# EAGLE design openlrsng (EAGLE 6.4)
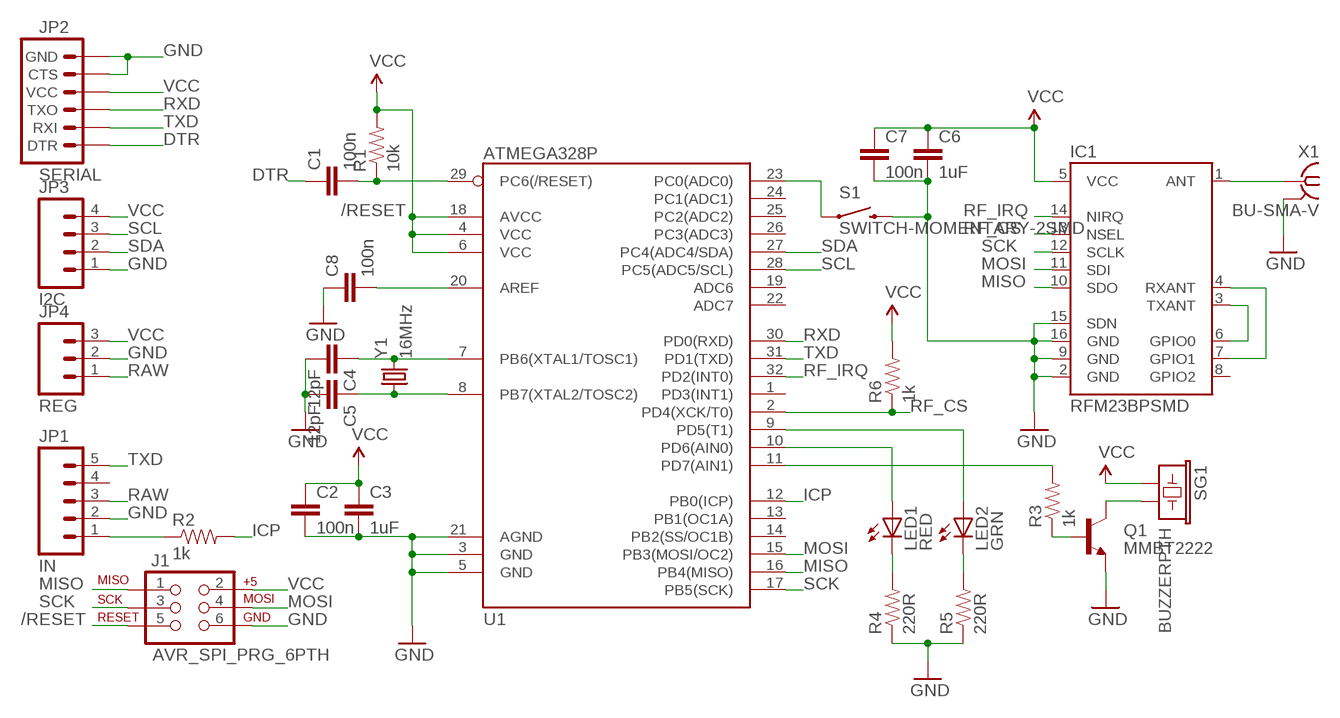
[diagram p0: schematic, sheet 1]

## Parts
C1  100n  CAP0805  [0805]
C2  100n  CAP0805  [0805]
C3  1uF  CAP0805  [0805]
C4  12pF  CAP0805  [0805]
C5  12pF  CAP0805  [0805]
C6  1uF  CAP0805  [0805]
C7  100n  CAP0805  [0805]
C8  100n  CAP0805  [0805]
IC1  RFM23BPSMD  [RFM23BP-S2]
J1  AVR_SPI_PRG_6PTH  [2X3]
JP1  IN  M05PTH  [1X05]
JP2  SERIAL  ARDUINO_SERIAL_PROGRAMPTH  [1X06]
JP3  I2C  M04PTH  [1X04]
JP4  REG  M03PTH  [1X03]
LED1  RED  LED3MM  [LED3MM]
LED2  GRN  LED3MM  [LED3MM]
Q1  MMBT2222  TRANSISTOR_NPNSOT23-3  [SOT23-3]
R1  10k  RESISTOR0402-RES  [0402-RES]
R2  1k  RESISTOR0402-RES  [0402-RES]
R3  1k  RESISTOR0402-RES  [0402-RES]
R4  220R  RESISTOR0402-RES  [0402-RES]
R5  220R  RESISTOR0402-RES  [0402-RES]
R6  1k  RESISTOR0402-RES  [0402-RES]
S1  SWITCH-MOMENTARY-2SMD  [TACTILE_SWITCH_SMD]
SG1  BUZZERPTH  [BUZZER-12MM]
U1  ATMEGA328P  ATMEGA328_SMT  [TQFP32-08]
X1  BU-SMA-V  [BU-SMA-V]
Y1  16MHz  CRYSTAL3.2X2.5  [CRYSTAL-SMD-5X3]

## Nets
/RESET: C1.2 J1.5 R1.1 U1.29(PC6(/RESET))
DTR: C1.1 JP2.1(DTR)
GND: C2.2 C3.2 C4.2 C5.2 C6.2 C7.2 C8.1 IC1.2(GND) IC1.9(GND) IC1.15(SDN) IC1.16(GND) J1.6 JP1.2 JP2.5(CTS) JP2.6(GND) JP3.1 JP4.2 Q1.2(E) R4.1 R5.1 S1.3 U1.3(GND) U1.5(GND) U1.21(AGND) X1.2 X1.3 X1.4 X1.5
ICP: R2.2 U1.12(PB0(ICP))
MISO: IC1.10(SDO) J1.1 U1.16(PB4(MISO))
MOSI: IC1.11(SDI) J1.4 U1.15(PB3(MOSI/OC2))
N$1: IC1.3(TXANT) IC1.6(GPIO0)
N$2: IC1.4(RXANT) IC1.7(GPIO1)
N$3: JP1.1 R2.1
N$4: R3.2 U1.11(PD7(AIN1))
N$5: Q1.1(B) R3.1
N$6: Q1.3(C) SG1.-
N$7: LED1.A U1.10(PD6(AIN0))
N$8: LED2.A U1.9(PD5(T1))
N$9: LED1.K(C) R4.2
N$10: LED2.K(C) R5.2
N$11: C4.1 U1.7(PB6(XTAL1/TOSC1)) Y1.3
N$12: C5.1 U1.8(PB7(XTAL2/TOSC2)) Y1.1
N$13: IC1.1(ANT) X1.1
N$14: C8.2 U1.20(AREF)
N$15: S1.1 U1.23(PC0(ADC0))
RAW: JP1.3 JP4.1
RF_CS: IC1.13(NSEL) R6.1 U1.2(PD4(XCK/T0))
RF_IRQ: IC1.14(NIRQ) U1.32(PD2(INT0))
RXD: JP2.3(TXO) U1.30(PD0(RXD))
SCK: IC1.12(SCLK) J1.3 U1.17(PB5(SCK))
SCL: JP3.3 U1.28(PC5(ADC5/SCL))
SDA: JP3.2 U1.27(PC4(ADC4/SDA))
TXD: JP1.5 JP2.2(RXI) U1.31(PD1(TXD))
VCC: C2.1 C3.1 C6.1 C7.1 IC1.5(VCC) J1.2 JP2.4(VCC) JP3.4 JP4.3 R1.2 R6.2 SG1.+ U1.4(VCC) U1.6(VCC) U1.18(AVCC)
Unconnected: IC1.8(GPIO2) JP1.4 U1.1(PD3(INT1)) U1.13(PB1(OC1A)) U1.14(PB2(SS/OC1B)) U1.19(ADC6) U1.22(ADC7) U1.24(PC1(ADC1)) U1.25(PC2(ADC2)) U1.26(PC3(ADC3))

## Library data of the parts
C1-C8 = SparkFun-Capacitors:CAP: Capacitor Standard 0603 ceramic capacitor, and 0.1" leaded capacitor.
IC1 = RFM23:RFM23BP: The RFM23BP is a medium power, low cost radio that is capable of operating in the 434MHz and 900MHz open bands. It's frequency is software defined and there are some very good libraries written for it.
J1 = SparkFun-Connectors:AVR_SPI_PRG_6: AVR ISP 6 Pin This is the reduced ISP connector for AVR programming. Common on Arduino. This footprint will take up less PCB space and can be used with a 10-pin to 6-pin adapter such as SKU: BOB-08508
JP1 = SparkFun-Connectors:M05: Header 5 Standard 5-pin 0.1" header. Use with straight break away headers (SKU : PRT-00116), right angle break away headers (PRT-00553), swiss pins (PRT-00743), machine pins (PRT-00117), and female headers (PRT-00115). Molex polarized connector foot print use with SKU : PRT-08230 with associated crimp pins and housings.
JP2 = SparkFun-Connectors:ARDUINO_SERIAL_PROGRAM: FTDI connector footprints
JP3 = SparkFun-Connectors:M04: Header 4 Standard 4-pin 0.1" header. Use with straight break away headers (SKU : PRT-00116), right angle break away headers (PRT-00553), swiss pins (PRT-00743), machine pins (PRT-00117), and female headers (PRT-00115). Molex polarized connector foot print use with SKU : PRT-08231 with associated crimp pins and housings. 1MM SMD Version SKU: PRT-10208
JP4 = SparkFun-Connectors:M03: Header 3 Standard 3-pin 0.1" header. Use with straight break away headers (SKU : PRT-00116), right angle break away headers (PRT-00553), swiss pins (PRT-00743), machine pins (PRT-00117), and female headers (PRT-00115). Molex polarized connector foot print use with SKU : PRT-08232 with associated crimp pins and housings.
LED1 LED2 = SparkFun-LED:LED: LEDs Standard schematic elements and footprints for 5mm, 3mm, 1206, and 0603 sized LEDs. 5mm - Spark Fun Electronics SKU : COM-00529 (and others)
Q1 = SparkFun-DiscreteSemi:TRANSISTOR_NPN: Generic NPN BJT. MMBT2222 is the common NPN we use. Double check against datasheet- not all devices are the same!
R1-R6 = SparkFun-Resistors:RESISTOR: Resistor Basic schematic elements and footprints for 0603, 1206, and PTH resistors.
S1 = SparkFun-Electromechanical:SWITCH-MOMENTARY-2: Various NO switches- pushbuttons, reed, etc
SG1 = SparkFun-Electromechanical:BUZZER: Buzzer 12mm Spark Fun Electronics SKU : Comp-Buzzer
U1 = SparkFun-DigitalIC:ATMEGA328_SMT: 32-Pin Atmega328 part Commonly used on Arduino compatible boards Available in QFP and QFN packages TQFP is IC-09069 QFN is non-stock; PROD_ID: IC-09069
X1 = con-coax:BU-SMA-V: FEMALE SMA CONNECTOR Radiall distributor RS 112-3794; OC_FARNELL: unknown; OC_NEWARK: unknown
Y1 = crystal_3225:CRYSTAL: Various standard crystals. Proven footprints. Spark Fun Electronics SKU : COM-00534

## Board
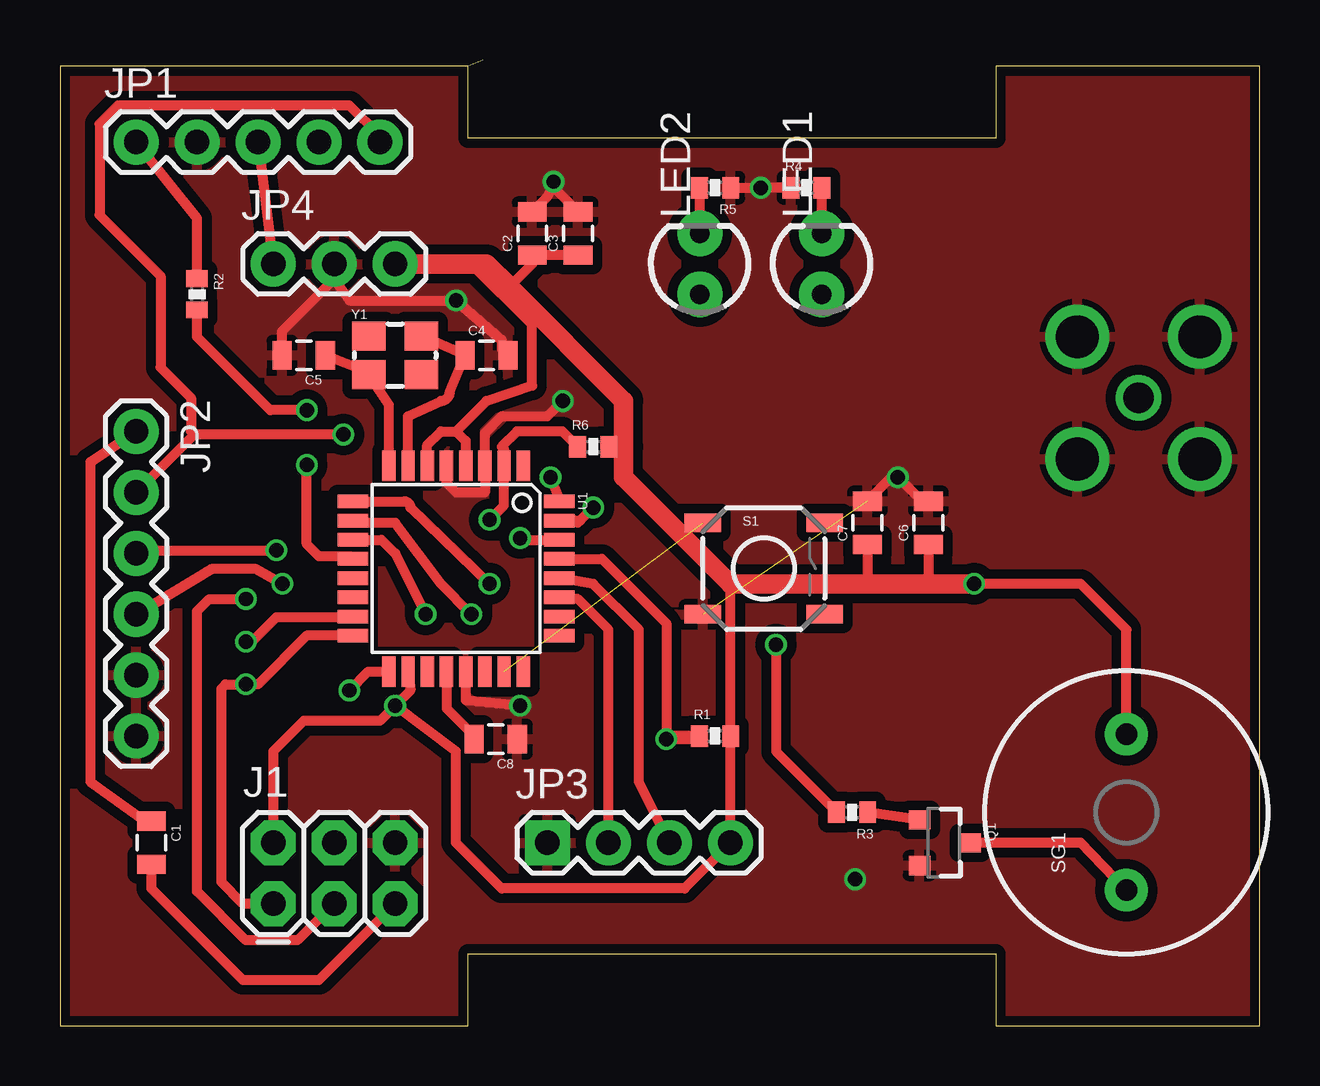
[diagram p1: board, top side]
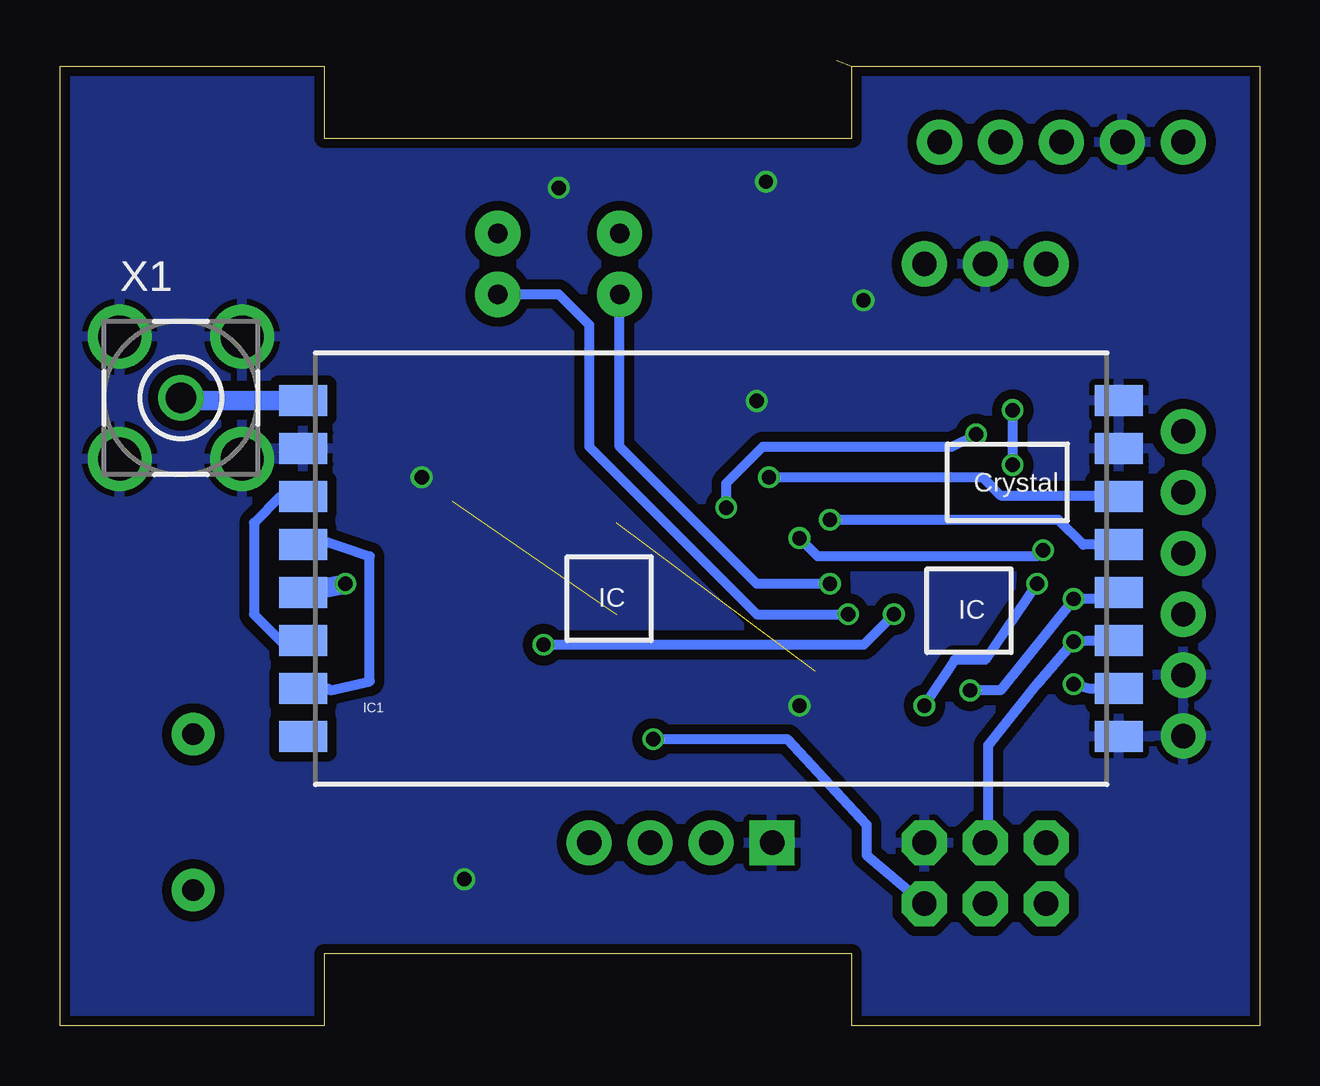
[diagram p2: board, bottom side, seen from below]

Size 50 x 40.25 mm. Coordinates in mm from the lower left corner, seen from the top.
Outline: 17,40 17,37 39,37 39,40 50,40 50,0 39,0 39,3 17,3 17,0 0,0 0,40 17,40
Outline: 17.64,40.25 17,40
Copper layers (1*16): Top 0.035mm / dielectric 1.5mm / Bottom 0.035mm
Design rules "ITEADstudio_DRC": minimum track width 6mil, minimum drill 12mil, track to track 6mil, track to pad 6mil, pad to pad 6mil, via to via 6mil, smd to smd 0mil, copper to edge 10mil, drill to drill 10mil, minimum pad ring 10mil, minimum via ring 6mil, stop-mask expansion 2mil, vias tented up to drill 100mil, thermal gap 10mil

### Footprints (pad centres in the part's own frame; a part is rotated, then mirrored left to right if it is on the bottom)
0805 = smd 0.8 x 1.2: 1 -0.9,0; 2 0.9,0
RFM23BP-S2 = smd 2 x 1.3: 1 -17,7; 2 -17,5; 3 -17,3; 4 -17,1; 5 -17,-1; 6 -17,-3; 7 -17,-5; 8 -17,-7; 9 17,-7; 10 17,-5; 11 17,-3; 12 17,-1; 13 17,1; 14 17,3; 15 17,5; 16 17,7
2X3 = drill 1.016 pad 1.88 octagon: 1 0,0; 2 0,2.54; 3 2.54,0; 4 2.54,2.54; 5 5.08,0; 6 5.08,2.54
1X05 = drill 1.016 pad 1.88: 1 0,0; 2 2.54,0; 3 5.08,0; 4 7.62,0; 5 10.16,0
1X06 = drill 1.016 pad 1.88: 1 0,0; 2 2.54,0; 3 5.08,0; 4 7.62,0; 5 10.16,0; 6 12.7,0
1X04 = drill 1.016 pad 1.88 square: 1 0,0 | drill 1.016 pad 1.88: 2 2.54,0; 3 5.08,0; 4 7.62,0
1X03 = drill 1.016 pad 1.88: 1 0,0; 2 2.54,0; 3 5.08,0
LED3MM = drill 0.813 pad 1.88: A -1.27,0; K 1.27,0
SOT23-3 = smd 0.8 x 0.9: 1 -0.95,-1; 2 0.95,-1; 3 0,1.1
0402-RES = smd 0.7 x 0.9: 1 -0.65,0; 2 0.65,0
TACTILE_SWITCH_SMD = smd 1.524 x 0.762: 1 -2.54,1.905; 2 2.54,1.905; 3 -2.54,-1.905; 4 2.54,-1.905
BUZZER-12MM = drill 0.9 pad 1.778: + 3.25,0; - -3.25,0
TQFP32-08 = smd 1.27 x 0.559: 1 -4.293,2.8; 2 -4.293,2; 3 -4.293,1.2; 4 -4.293,0.4; 5 -4.293,-0.4; 6 -4.293,-1.2; 7 -4.293,-2; 8 -4.293,-2.8; 17 4.293,-2.8; 18 4.293,-2; 19 4.293,-1.2; 20 4.293,-0.4; 21 4.293,0.4; 22 4.293,1.2; 23 4.293,2; 24 4.293,2.8 | smd 0.559 x 1.27: 9 -2.8,-4.293; 10 -2,-4.293; 11 -1.2,-4.293; 12 -0.4,-4.293; 13 0.4,-4.293; 14 1.2,-4.293; 15 2,-4.293; 16 2.8,-4.293; 25 2.8,4.293; 26 2,4.293; 27 1.2,4.293; 28 0.4,4.293; 29 -0.4,4.293; 30 -1.2,4.293; 31 -2,4.293; 32 -2.8,4.293
BU-SMA-V = drill 1.27: 1 0,0 | drill 1.778: 2 -2.55,2.55; 3 2.55,2.55; 4 2.55,-2.55; 5 -2.55,-2.55
CRYSTAL-SMD-5X3 = smd 1.4 x 1.2: 1 -1.1,-0.8; 2 1.1,-0.8; 3 1.1,0.8; 4 -1.1,0.8

### Placement (x,y rotation side)
C1  3.81,7.62 270 top
C2  19.69,33.02 90 top
C3  21.59,33.02 90 top
C4  17.78,27.94 0 top
C5  10.16,27.94 180 top
C6  36.2,20.95 90 top
C7  33.66,20.95 90 top
C8  18.16,11.94 180 top
IC1  22.86,19.05 0 bottom
J1  8.89,5.08 0 top
JP1  3.17,36.83 0 top
JP2  3.17,24.77 270 top
JP3  20.32,7.62 0 top
JP4  8.89,31.75 0 top
LED1  31.75,31.75 90 top
LED2  26.67,31.75 90 top
Q1  36.83,7.62 270 top
R1  27.31,12.06 0 top
R2  5.71,30.48 270 top
R3  33.02,8.89 180 top
R4  31.12,34.92 0 top
R5  27.31,34.92 180 top
R6  22.23,24.13 0 top
S1  29.34,19.05 0 top
SG1  44.45,8.89 90 top
U1  16.51,19.05 270 top
X1  44.96,26.16 0 bottom
Y1  13.97,27.94 0 top

### Tracks (layer width: path | path; a pad name or v marks a point on that pad's centre or on a via)
/RESET  (via drill 0.6)
  Top 0.406: C1.2 3.81,5.71 7.62,1.91 10.79,1.91 J1.5 | U1.29 22.59,19.45 25.27,16.76 v25.27,11.94 | v25.27,11.94 26.53,11.94 R1.1 25.4,12.06 v25.27,11.94
  Bottom 0.406: v25.27,11.94 19.69,11.94 16.38,8.38 16.38,7.11 J1.5
DTR
  Top 0.406: JP2.1 1.27,23.5 1.27,10.16 3.54,8.52 C1.1
GND  (via drill 0.6)  (1 unrouted)
  Top 0.406: U1.5 16.11,22.62 16.51,22.23 17.71,22.23 U1.3 17.71,24.7 18.42,25.4 20.32,25.4 v20.96,26.04 | C5.2 9.26,28.95 11.43,31.11 | JP4.2 11.43,31.11 | 11.43,31.11 12.06,30.23 v16.51,30.23 18.42,28.57 18.42,28.2 C4.2 | Q1.2 35.83,6.62 | U1.21 16.91,13.57 v19.18,13.34 | R5.1 v29.21,34.92 R4.1 | C6.2 35.93,21.86 v34.92,22.86 34.66,22.86 C7.2 | C3.2 20.59,34.92 v20.57,35.18 20.32,34.55 C2.2
  other vias: 33.15,6.1
  pour Bottom (isolate 0.406): 0,41.27 53.34,41.27 53.34,-0.64 52.7,-1.27 0,-1.27
  pour Top (isolate 0.406): -1.91,41.91 52.7,41.91 53.98,40.64 53.98,0 52.7,-1.27 -1.91,-1.27
ICP  (via drill 0.6)
  Top 0.406: U1.12 12.11,19.56 10.79,19.56 10.29,20.07 v10.29,23.37 | v10.29,25.65 8.76,25.65 5.71,28.7 R2.2
  Bottom 0.406: v10.29,23.37 v10.29,25.65
MISO  (via drill 0.6)
  Top 0.406: J1.1 7.62,5.08 6.73,5.97 6.73,14.05 6.9,14.22 v7.75,14.22 8.26,14.22 10.29,16.26 U1.16
  Bottom 0.406: v7.75,14.22 7.06,14.05 IC1.10
MOSI  (via drill 0.6)
  Top 0.406: U1.15 12.19,17.02 9.02,17.02 8,16 v7.75,16
  Bottom 0.406: IC1.11 7.19,16.05 v7.75,16 9.27,14.22 11.3,11.68 11.3,7.75 J1.4
N$1
  Bottom 0.406: IC1.3 40.81,22.05 41.91,20.95 41.91,17.14 40.64,15.88 40.03,15.88 IC1.6
N$2
  Bottom 0.406: IC1.7 38.81,14.05 38.73,13.97 37.08,14.35 37.08,19.56 39.37,20.32 39.59,20.32 IC1.4
N$3
  Top 0.406: R2.1 5.71,33.66 JP1.1
N$4  (via drill 0.6)
  Top 0.406: U1.11 13.4,20.25 13.97,19.68 v15.24,17.14 | v29.85,15.88 29.85,11.43 32.38,8.89 R3.2
  Bottom 0.406: v15.24,17.14 16.51,15.88 v29.85,15.88
N$5
  Top 0.406: Q1.1 R3.1
N$6
  Top 0.406: SG1.- 42.54,7.62 Q1.3
N$7  (via drill 0.6)
  Top 0.406: v17.15,17.14 15.88,18.41 13.97,20.95 12.31,20.95 U1.10
  Bottom 0.406: LED1.A 29.21,30.48 27.94,29.21 27.94,24.13 20.96,17.14 v17.15,17.14
N$8  (via drill 0.6)
  Top 0.406: U1.9 14.35,21.85 arc-90 14.61,21.59 v17.91,18.41
  Bottom 0.406: v17.91,18.41 20.96,18.41 26.67,24.13 LED2.A
N$9
  Top 0.406: LED1.K 31.75,34.91 R4.2
N$10
  Top 0.406: R5.2 26.66,33.03 LED2.K
N$11
  Top 0.406: U1.7 14.51,25.4 15.88,26.04 arc90 16.25,26.41 C4.1 Y1.3
N$12
  Top 0.406: U1.8 13.71,25.87 Y1.1 13.13,27.14 C5.1
N$13
  Bottom 0.813: IC1.1 44.85,26.05 X1.1
N$14
  Top 0.406: C8.2 17.26,12.08 16.13,13.21 16.13,14.74 U1.20
N$15  (1 unrouted)
RAW
  Top 0.406: JP1.3 JP4.1
RF_CS  (via drill 0.6)
  Top 0.406: R6.1 20.94,24.77 19.05,24.77 18.42,24.13 18.51,24.04 U1.2 18.51,21.68 v17.91,21.08
  Bottom 0.406: IC1.13 7.35,20.05 8.38,21.08 v17.91,21.08
RF_IRQ  (via drill 0.6)
  Top 0.406: U1.32 20.8,22 v20.45,22.86
  Bottom 0.406: v20.45,22.86 11.56,22.86 10.79,22.1 5.91,22.1 IC1.14
RXD  (via drill 0.6)
  Top 0.406: JP2.3 3.3,19.81 v9.02,19.81 | v19.18,20.32 19.25,20.25 U1.30
  Bottom 0.406: v9.02,19.81 9.27,19.56 18.42,19.56 v19.18,20.32
SCK  (via drill 0.6)
  Top 0.406: J1.3 9.91,3.56 7.75,3.56 5.71,5.59 5.71,17.27 6.22,17.78 v7.75,17.78 | v12.06,13.97 12.85,14.76 U1.17
  Bottom 0.406: v12.06,13.97 10.79,13.97 v7.75,17.78 6.13,17.78 IC1.12
SCL
  Top 0.406: JP3.3 24.13,10.16 24.13,16.51 22.23,18.41 U1.28
SDA
  Top 0.406: JP3.2 22.86,16.51 21.59,17.78 U1.27
TXD  (via drill 0.6)
  Top 0.406: 21.59,20.95 21.5,21.05 U1.31 21.69,21.05 v22.23,21.59 | v11.81,24.64 5.59,24.64 | 5.59,24.64 JP2.2 | JP1.5 13.33,37.08 12.06,38.35 2.41,38.35 1.65,37.59 1.65,33.78 4.19,31.24 4.19,27.43 5.46,26.16 5.46,24.77 5.59,24.64
  Bottom 0.406: v22.23,21.59 22.23,22.61 20.7,24.13 12.83,24.13 v11.81,24.64
VCC  (via drill 0.6)
  Top 0.406: U1.6 15.31,24.2 15.88,24.77 16.51,24.77 | 16.51,24.77 16.91,24.36 U1.4 | JP2.4 6.35,19.05 8.13,19.05 v9.27,18.41 | U1.18 14.61,13.97 v13.97,13.34 | v13.97,13.34 13.33,12.7 10.16,12.7 8.89,11.43 J1.2 | SG1.+ 44.45,16.51 42.54,18.41 v38.1,18.41 | v13.97,13.34 16.51,11.43 16.51,7.62 18.42,5.71 26.04,5.71 JP3.4 R1.2 27.96,18.4 27.94,18.41 | 16.51,24.77 17.78,26.04 19.69,26.67 19.69,29.21 17.15,31.75 JP4.3 | C7.1 33.66,18.41 | C6.1 36.2,18.41 | 18.73,30.8 19.69,31.75 C2.1 C3.1 | R6.2 23.5,24.13
  Top 0.813: v38.1,18.41 36.2,18.41 33.66,18.41 27.94,18.41 23.5,22.86 23.5,24.13 23.5,26.04 18.73,30.8 17.78,31.75 JP4.3
  Bottom 0.406: v9.27,18.41 11.43,15.24 12.7,15.24 v13.97,13.34
  Bottom 0.813: v38.1,18.41 IC1.5